# Altium schematic sheet SDI.SchDoc
size A4; DocumentNumber: 4; SheetNumber: 4; SheetTotal: 4; PageSetup: Record=PageOptions|CenterHorizontal=True|CenterVertical=True|PrintScale=0.97|XCorrection=1.00|YCorrection=1.00|PrintKind=1|BorderSize=5000000|LeftOffset=0|BottomOffset=0|Orientation=2|PaperLength=2970|PaperWidth=2100|Scale=100|PaperSource=7|PrintQuality=600|MediaType=1|DitherType=10|PaperKind=A4|PrintScaleMode=1
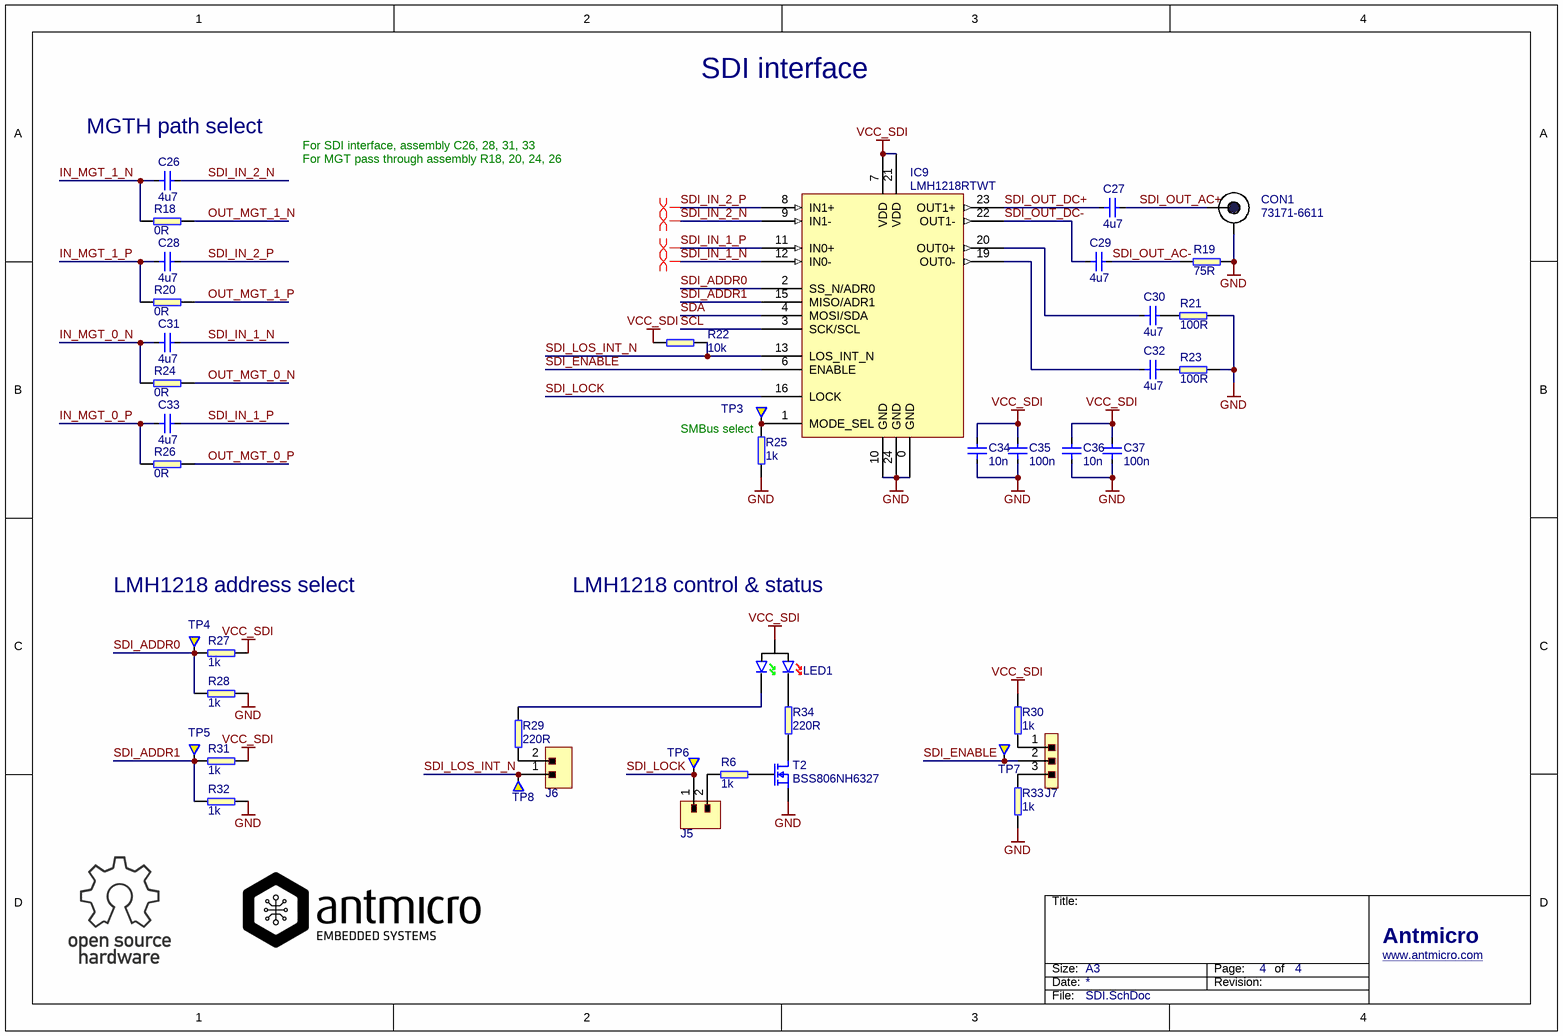
[diagram p0: SDI.SchDoc]

## Parts
C26  4u7  [0402]
C27  4u7  [0402]
C28  4u7  [0402]
C29  4u7  [0402]
C30  4u7  [0402]
C31  4u7  [0402]
C32  4u7  [0402]
C33  4u7  [0402]
C34  10n  [0402]
C35  100n  [0402]
C36  10n  [0402]
C37  100n  [0402]
CON1  73171-6611  [MOLEX_BNC_73171-6611]
IC9  LMH1218RTWT  [WQFN-24]
J5  MH_1X02_2.54  [MH_1X02_2.54]  (value not drawn)
J6  MH_1X02_2.54  [MH_1X02_2.54]  (value not drawn)
J7  MH_1X03_2.54  [MH_1X03_2.54]  (value not drawn)
LED1  LED-LiteON-LTST-S326KGJRKT  [LED-LiteON-LTST-S326KGJRKT]  (value not drawn)
R6  1k  [0603]
R18  0R  [0402]
R19  75R  [0402]
R20  0R  [0402]
R21  100R  [0402]
R22  10k  [0402]
R23  100R  [0402]
R24  0R  [0402]
R25  1k  [0402]
R26  0R  [0402]
R27  1k  [0603]
R28  1k  [0603]
R29  220R  [0402]
R30  1k  [0603]
R31  1k  [0603]
R32  1k  [0603]
R33  1k  [0603]
R34  220R  [0402]
T2  BSS806NH6327  [SOT-23]
TP3  Testpad  [Testpad]  (value not drawn)  (no BOM)
TP4  Testpad  [Testpad]  (value not drawn)  (no BOM)
TP5  Testpad  [Testpad]  (value not drawn)  (no BOM)
TP6  Testpad  [Testpad]  (value not drawn)  (no BOM)
TP7  Testpad  [Testpad]  (value not drawn)  (no BOM)
TP8  Testpad  [Testpad]  (value not drawn)  (no BOM)

## Nets
GND: C34.1 C35.1 C36.1 C37.1 CON1.S IC9.0(GND) IC9.10(GND) IC9.24(GND) R19.1 R21.1 R23.1 R25.1 R28.2 R32.2 R33.2 T2.2(S)
VCC_SDI: C34.2 C35.2 C36.2 C37.2 IC9.7(VDD) IC9.21(VDD) LED1.A R22.1 R27.2 R30.1 R31.2
IN_MGT_0_N: C31.1 R24.1
IN_MGT_0_P: C33.1 R26.1
IN_MGT_1_N: C26.1 R18.1
IN_MGT_1_P: C28.1 R20.1
OUT_MGT_0_N: R24.2
OUT_MGT_0_P: R26.2
OUT_MGT_1_N: R18.2
OUT_MGT_1_P: R20.2
SCL: IC9.3(SCK/SCL)
SDA: IC9.4(MOSI/SDA)
SDI_ADDR0: IC9.2(SS_N/ADR0) R27.1 R28.1 TP4.1
SDI_ADDR1: IC9.15(MISO/ADR1) R31.1 R32.1 TP5.1
SDI_ENABLE: IC9.6(ENABLE) J7.2 TP7.1
SDI_IN_1_N: C31.2 IC9.12(IN0-)
SDI_IN_1_P: C33.2 IC9.11(IN0+)
SDI_IN_2_N: C26.2 IC9.9(IN1-)
SDI_IN_2_P: C28.2 IC9.8(IN1+)
SDI_LOCK: IC9.16(LOCK) J5.1 TP6.1
SDI_LOS_INT_N: IC9.13(LOS_INT_N) J6.1 R22.2 TP8.1
SDI_OUT_AC+: C27.2 CON1.1
SDI_OUT_AC-: C29.2 R19.2
SDI_OUT_DC+: C27.1 IC9.23(OUT1+)
SDI_OUT_DC-: C29.1 IC9.22(OUT1-)
NetC30_1: C30.1 IC9.20(OUT0+)
NetC30_2: C30.2 R21.2
NetC32_1: C32.1 IC9.19(OUT0-)
NetC32_2: C32.2 R23.2
NetIC9_1: IC9.1(MODE_SEL) R25.2 TP3.1
NetJ5_2: J5.2 R6.1
NetJ6_2: J6.2 R29.2
NetJ7_1: J7.1 R30.2
NetJ7_3: J7.3 R33.1
NetLED1_C1: LED1.C1 R34.2
NetLED1_C2: LED1.C2 R29.1
NetR6_2: R6.2 T2.1(G)
NetR34_1: R34.1 T2.3(D)

## Layout directives
differential pair: SDI_IN_1_N, SDI_IN_1_P, SDI_IN_2_N, SDI_IN_2_P

## Notes on the sheet
- SDI interface
- (near C26) MGTH path select
- For SDI interface, assembly C26, 28, 31, 33
- For MGT pass through assembly R18, 20, 24, 26
- SMBus select
- LMH1218 address select
- LMH1218 control & status
- Title:
- Size:
- Date:
- A3
- Revision:
- Page:
- of
- Antmicro
- www.antmicro.com
- File:

## Library data of the parts
C26-C33 = C_4u7_0402: MLCC SMT Capacitor 0402; Manufacturer: MURATA; Part Symbol: GRM155R60G475ME; Value: 4u7; Part Number: C_4u7_0402
C34 C36 = C_10n_0402: MLCC SMT Capacitor 0402; Manufacturer: AVX; Part Symbol: 04025G103ZAT2A; Value: 10n; Part Number: C_10n_0402
C35 C37 = C_100n_0402: MLCC SMT Capacitor 0402; Manufacturer: MULTICOMP; Part Symbol: MC0402X104M100CT; Value: 100n; Part Number: C_100n_0402
CON1 = MOLEX_BNC_73171-6611: Manufacturer: MOLEX; Part Number: MOLEX_BNC_73171-6611; Value: 73171-6611; Part Symbol: 73171-6611
IC9 = LMH1218: Low Power Ultra HD Cable Driver with Integrated Reclocker; Manufacturer: TEXAS INSTRUMENTS; Part Number: LMH1218RTWT; Value: LMH1218RTWT; Part Symbol: LMH1218RTWT
J5 J6 = 1X02: Male header, 1 x 02 pins, pitch 2.54 mm; Manufacturer: MULTICOMP; Part Symbol: 2211S-02G; Part Number: MH_1X02_2.54; Value: MH_1X02_2.54
J7 = 1X03_1: Male header, 1 x 03 pins, pitch 2.54 mm; Manufacturer: HARWIN; Part Symbol: M20-9990345.; Part Number: MH_1X03_2.54; Value: MH_1X03_2.54
LED1 = LED-LiteON-LTST-S326KGJRKT: Standard LEDs - SMD Green/Red Clear 571nm/631nm; Manufacturer: Lite-On; Part Number: LED-LiteON-LTST-S326KGJRKT; Value: LED-LiteON-LTST-S326KGJRKT; Part Symbol: LTST-S326KGJRKT
R6 R27 R28 R30-R33 = R_1k_0603: SMT Resistor 0R 0603; Manufacturer: BOURNS; Part Symbol: CR0603-JW-102ELF; Value: 1k; Part Number: R_1k_0603
R18 R20 R24 R26 = R_0R_0402: SMT Resistor 0402; Manufacturer: MULTICOMP; Part Symbol: MCMR04X000 PTL; Value: 0R; Part Number: R_0R_0402
R19 = R_75R_0402: SMT Resistor 0402; Manufacturer: YAGEO(PHYCOMP); Part Symbol: RC0402FR-0775RL; Value: 75R; Part Number: R_75R_0402
R21 R23 = R_100R_0402: SMT Resistor 0402; Manufacturer: BOURNS; Part Symbol: CR0402-FX-1000GLF; Value: 100R; Part Number: R_100R_0402
R22 = R_10k_0402: SMT Resistor 0402; Manufacturer: MULTICOMP; Part Symbol: MCMR04X1002FTL; Value: 10k; Part Number: R_10k_0402
R25 = R_1k_0402: SMT Resistor 0402; Manufacturer: MULTICOMP; Part Symbol: MCMR04X1001FTL; Value: 1k; Part Number: R_1k_0402
R29 R34 = R_220R_0402: SMT Resistor 0402; Manufacturer: TE CONNECTIVITY; Part Symbol: CRG0402J220R; Value: 220R; Part Number: R_220R_0402
T2 = BSS806NH6327: MOSFET, BRT, N CH, 2.3 A, 20 V, 0.041 ohm, 2.5 V, 550 mV; Manufacturer: INFINEON; Part Symbol: BSS806NH6327XTSA1; Value: BSS806NH6327; Part Number: BSS806NH6327
TP3-TP8 = Testpad: Testpad 2mm diameter; Manufacturer: PCB ONLY; Part Number: Testpad; Part Symbol: PCB ONLY